# EAGLE schematic Placa de processamento (EAGLE 9.6.2)
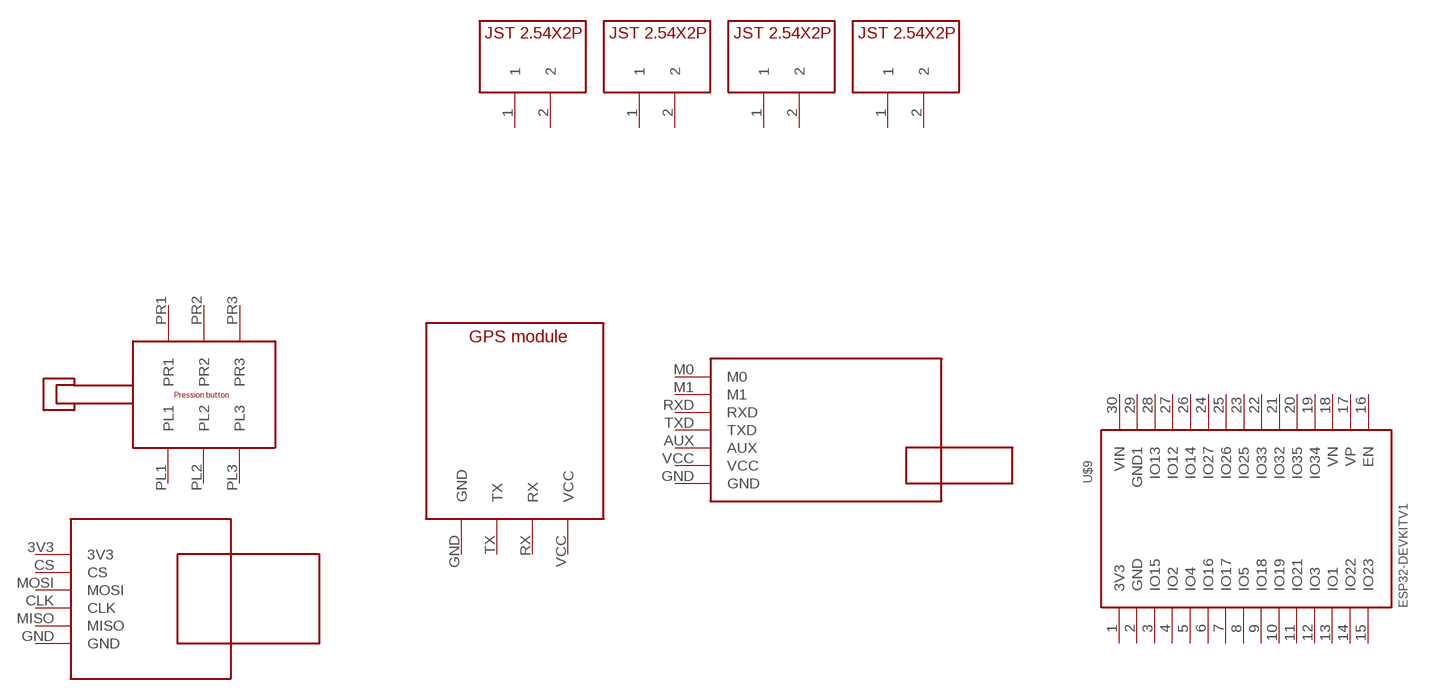
[diagram p0: schematic, sheet 1]

## Parts
U$1  PRESSION_BUTTON  [PRESSION_BUTTON_FOOTPRINT]
U$2  MICROSD_SMALL_READER  [MICROSD_SMALL_READER_FOOTPRINT]
U$3  JST2.54X2P  [JST2.54X2P_FOOTPRINT]
U$4  JST2.54X2P  [JST2.54X2P_FOOTPRINT]
U$5  JST2.54X2P  [JST2.54X2P_FOOTPRINT]
U$6  JST2.54X2P  [JST2.54X2P_FOOTPRINT]
U$7  GPS_MODULE  [GPS_MODULE_FOOTPRINT]
U$8  E22-400T30D  [E22-400T30D_FOOTPRINT]
U$9  ESP32DEVKITV1  [ESP32-DEVKITV1]
Unconnected: U$1.PL1 U$1.PL2 U$1.PL3 U$1.PR1 U$1.PR2 U$1.PR3 U$2.3V3 U$2.CLK U$2.CS U$2.GND U$2.MISO U$2.MOSI U$3.1 U$3.2 U$4.1 U$4.2 U$5.1 U$5.2 U$6.1 U$6.2 U$7.GND U$7.RX U$7.TX U$7.VCC U$8.AUX U$8.GND U$8.M0 U$8.M1 U$8.RXD U$8.TXD U$8.VCC U$9.1(3V3) U$9.2(GND) U$9.3(IO15) U$9.4(IO2) U$9.5(IO4) U$9.6(IO16) U$9.7(IO17) U$9.8(IO5) U$9.9(IO18) U$9.10(IO19) U$9.11(IO21) U$9.12(IO3) U$9.13(IO1) U$9.14(IO22) U$9.15(IO23) U$9.16(EN) U$9.17(VP) U$9.18(VN) U$9.19(IO34) U$9.20(IO35) U$9.21(IO32) U$9.22(IO33) U$9.23(IO25) U$9.24(IO27) U$9.25(IO26) U$9.26(IO14) U$9.27(IO12) U$9.28(IO13) U$9.29(GND1) U$9.30(VIN)

## Library data of the parts
U$1 = CRD:PRESSION_BUTTON
U$2 = CRD:MICROSD_SMALL_READER
U$3-U$6 = CRD:JST2.54X2P: Conector JST 2 pinos (2.54mm de distância entre pinos)
U$7 = CRD:GPS_MODULE
U$8 = CRD:E22-400T30D
U$9 = ESP32-DEVKITV1:ESP32DEVKITV1